# EasyEDA Pro project 2Axis-5.0-南塘 - (0522).eprj, board 2轴南塘
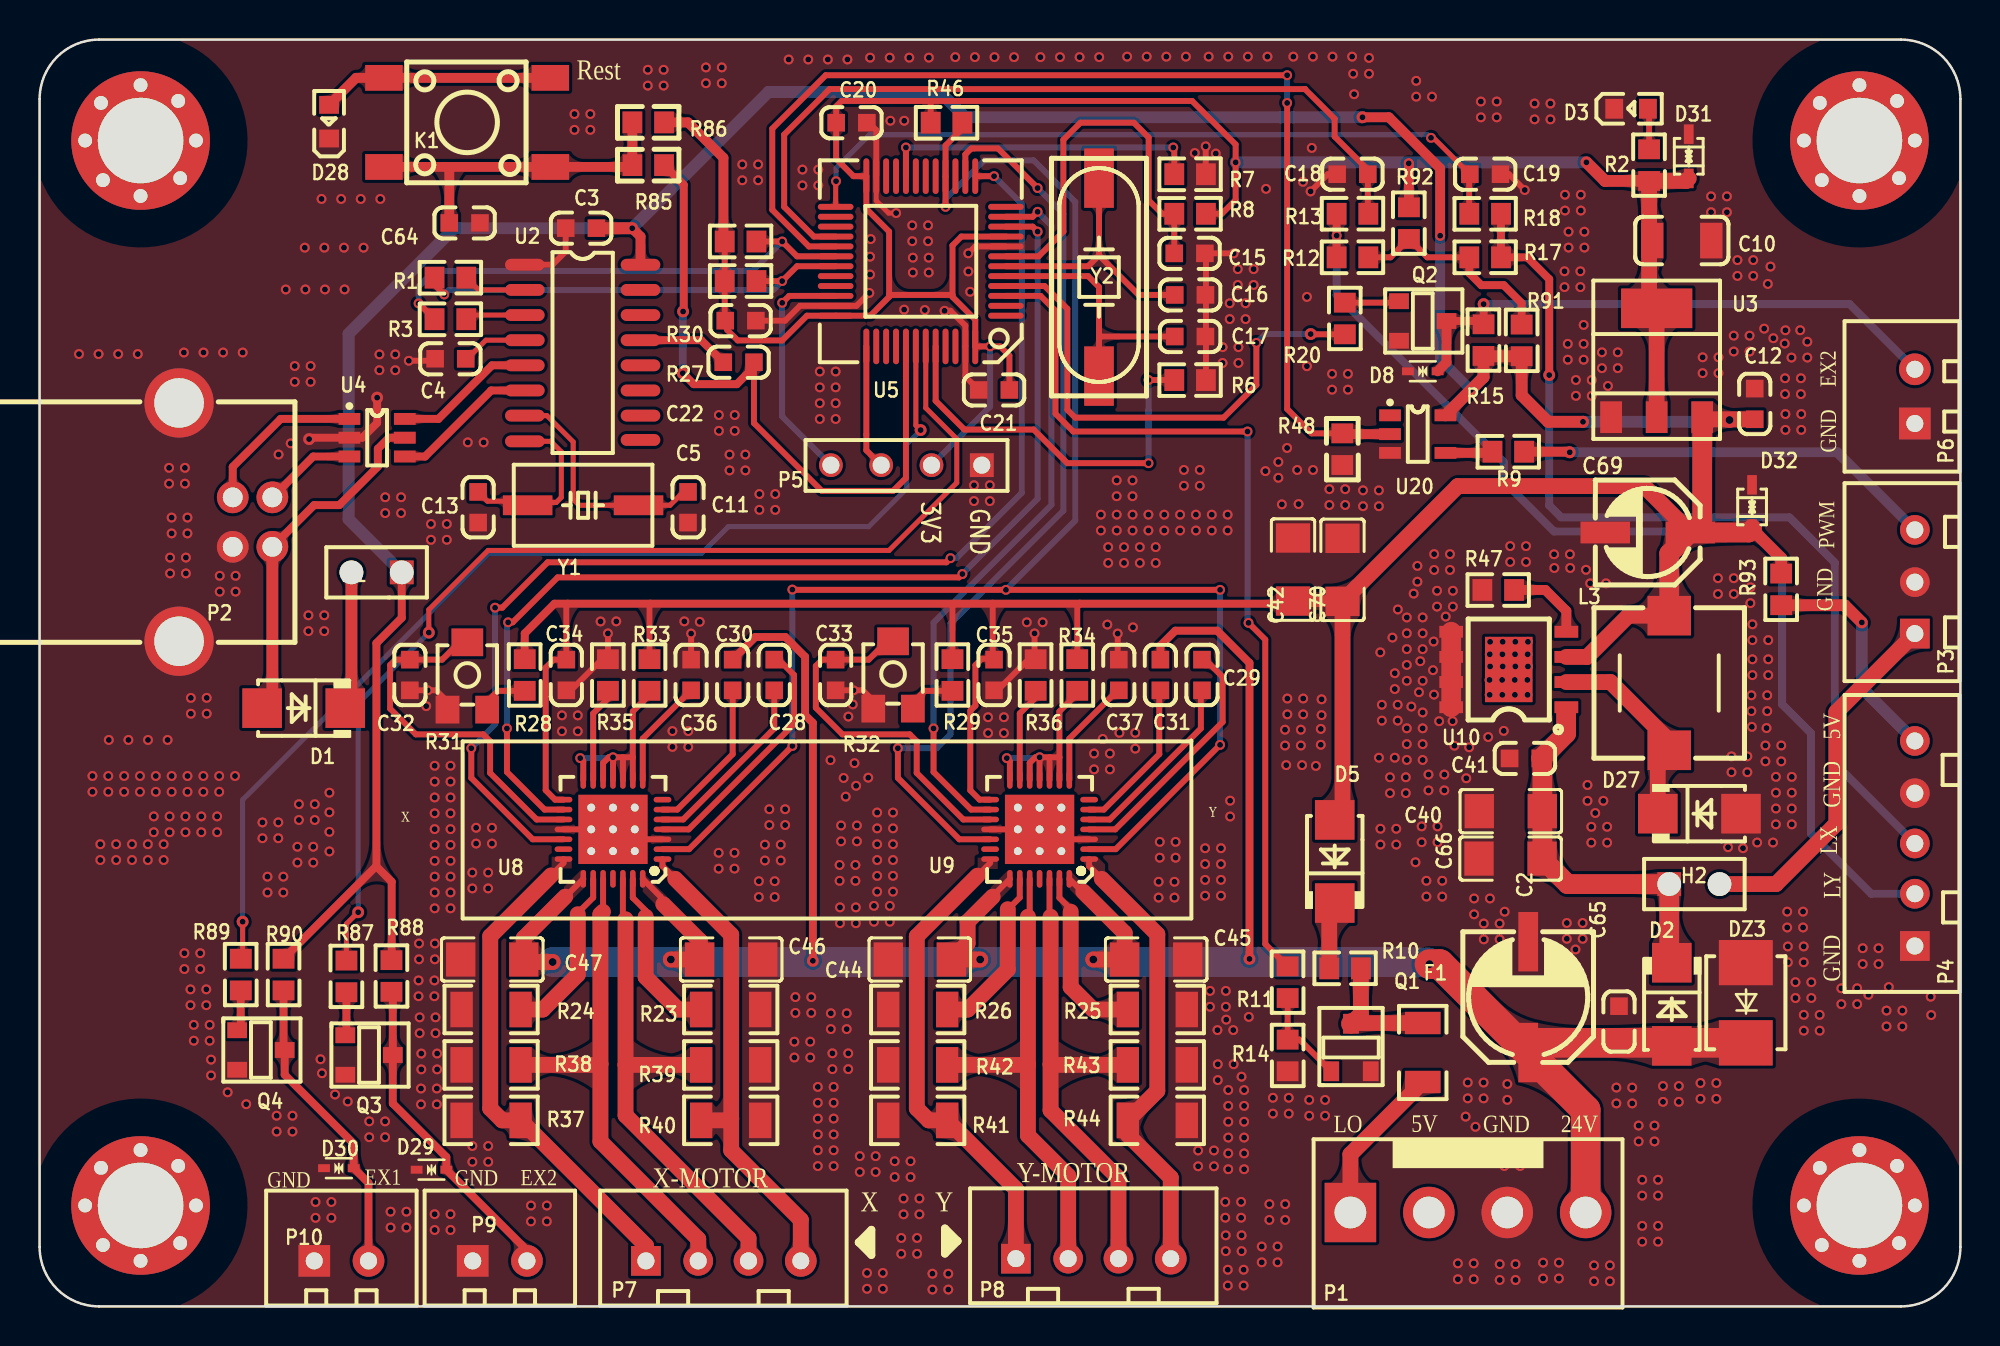
[diagram p2: board, top side]
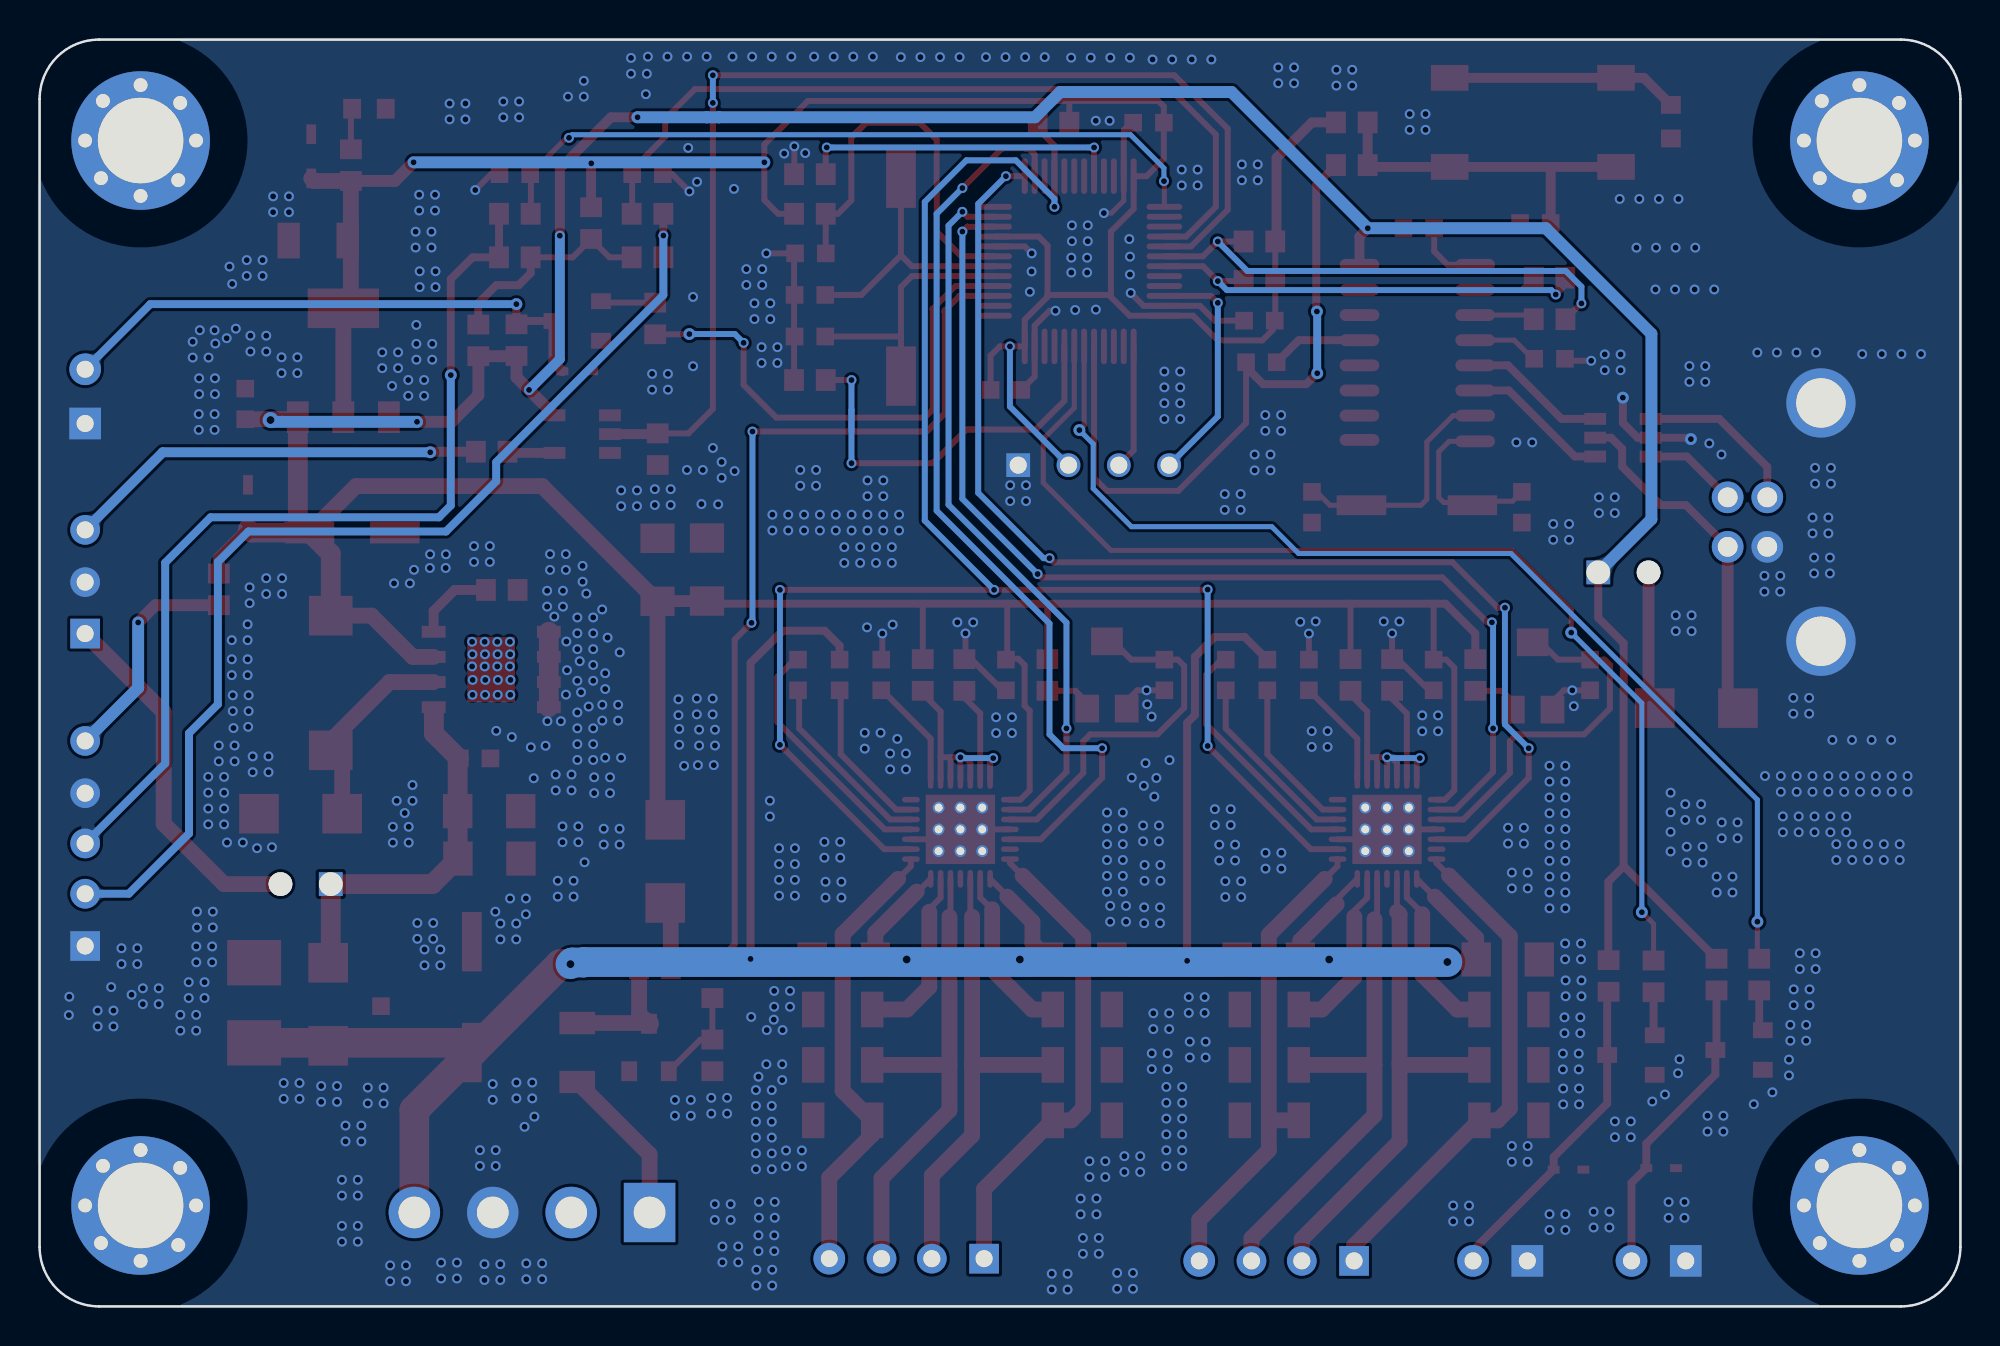
[diagram p3: board, bottom side, seen from below]

Outline 97 x 64 mm; copper layers: Top Layer, Bottom Layer. Coordinates in mm from the lower left corner of the outline.
Outline path: 0,61 0,3 arc(0.88,0.88) 3,0 94,0 arc(96.12,0.88) 97,3 97,61 arc(96.12,63.12) 94,64 3,64 arc(0.88,63.12) 0,61
Stack: Top Layer 0.0356mm / Dielectric1 0.32mm FR-4 er 4.8 / Bottom Layer 0.0356mm

## Design rules (mm)
net C1: M2-9764
net C2: M2-9764
net C3: M2-9764
net C4: M2-9764
net C5: M2-9764
net C6: M2-9764
net C8: M2-9764
net C9: M2-9764
net C10: M2-9764
net C11: M2-9764
net C12: M2-9764
net C13: M2-9764
net C15: M2-9764
net C16: M2-9764
net C17: M2-9764
net C18: M2-9764
net C19: M2-9764
net C20: M2-9764
net C21: M2-9764
net C22: M2-9764
net C23: M2-9764
net C24: M2-9764
net C25: M2-9764
net C26: M2-9764
net C27: M2-9764
net C28: M2-9764
net C29: M2-9764
net C30: M2-9764
net C31: M2-9764
net C32: M2-9764
net C33: M2-9764
net C34: M2-9764
net C35: M2-9764
net C36: M2-9764
net C37: M2-9764
net C38: M2-9764
net D1: M2-9764
net D2: M2-9764
net D3: M2-9764
net D5: M2-9764
net D6: M2-9764
net DZ2: M2-9764
net DZ3: M2-9764
net DZ4: M2-9764
net DZ5: M2-9764
net F1: M2-9764
net P1: M2-9764
net P2: M2-9764
net P3: M2-9764
net P4: M2-9764
net P5: M2-9764
net P6: M2-9764
net P7: M2-9764
net P8: M2-9764
net P10: M2-9764
net Q1: M2-9764
net Q2: M2-9764
net R1: M2-9764
net R2: M2-9764
net R3: M2-9764
net R6: M2-9764
net R7: M2-9764
net R8: M2-9764
net R9: M2-9764
net R10: M2-9764
net R11: M2-9764
net R12: M2-9764
net R13: M2-9764
net R15: M2-9764
net R16: M2-9764
net R17: M2-9764
net R18: M2-9764
net R19: M2-9764
net R20: M2-9764
net R22: M2-9764
net R23: M2-9764
net R24: M2-9764
net R25: M2-9764
net R26: M2-9764
net R28: M2-9764
net R29: M2-9764
net R31: M2-9764
net R32: M2-9764
net R33: M2-9764
net R34: M2-9764
net R35: M2-9764
net R36: M2-9764
net R37: M2-9764
net R38: M2-9764
net R39: M2-9764
net R40: M2-9764
net R41: M2-9764
net R42: M2-9764
net R43: M2-9764
net R44: M2-9764
net R45: M2-9764
net U1: M2-9764
net U2: M2-9764
net U3: M2-9764
net U4: M2-9764
net U5: M2-9764
net U7: M2-9764
net U8: M2-9764
net U9: M2-9764
net Y1: M2-9764
net Y2: M2-9764
net J1: M2-9764
net R46: M2-9764
net R14: M2-9764
net R21: M2-9764
net R27: M2-9764
net R30: M2-9764
net U10: M2-9764
net : Inside Board Components
spacing Clearance (default): track to track 0.178, other pairs 0.178 to 0.178
track width Width (default): min 0.1, default 0.254, max 5
differential pair DiffPairsRouting (default): width min 0.381, default 0.381, max 0.381; gap min 0.254, default 0.254
via RoutingVias (default): diameter min 0.3, default 0.8, max 1.27; hole min 0.3, default 0.6, max 2

## Placement (name value [footprint] x y rotation side)
C2  100uF/35V  [电解电容贴片6X6]  75.17 15.63 90 top
C3  104  [0603C]  27.35 54.47 180 top
C4  104  [0603C]  20.75 47.87 180 top
C5  104  [0603C]  35.3 47.7 0 top
C10  106/50V  [1206C]  82.93 53.85 0 top
C11  18pF  [0603C]  32.75 40.37 270 top
C12  104  [0603C]  86.61 45.59 270 top
C13  18pF  [0603C]  22.15 40.37 270 top
C15  104  [0603C]  58.07 53.2 180 top
C16  100pF  [0603C]  58.1 51.1 0 top
C17  100pF  [0603C]  58.1 49 0 top
C18  104  [0603C]  66.3 57.2 0 top
C19  104  [0603C]  73 57.2 180 top
C20  104  [0603C]  41 59.8 180 top
C21  104  [0603C]  48.2 46.3 0 top
C22  104  [0603C]  35.4 49.8 180 top
C28  104  [0603C]  37.1 31.9 270 top
C29  104  [0603C]  58.7 31.9 270 top
C30  104  [0603C]  35 31.9 90 top
C31  104  [0603C]  56.6 31.9 90 top
C32  104  [0603C]  18.7 31.9 270 top
C33  104  [0603C]  40.2 31.9 270 top
C34  104  [0603C]  26.6 31.9 270 top
C35  104  [0603C]  48.2 31.9 270 top
C36  224  [0603C]  32.9 31.9 90 top
C37  224  [0603C]  54.5 31.9 90 top
C40  10uF  [C1206]  74.29 25.02 0 top
C41  104  [0603C]  75.01 27.68 0 top
C42  10uF  [C1206]  63.3 37.23 90 top
C44  10uF  [C1206]  44.45 17.53 180 top
C45  10uF  [C1206]  56.39 17.53 0 top
C46  10uF  [C1206]  34.93 17.53 0 top
C47  10uF  [C1206]  22.86 17.53 180 top
C64  103  [0603C]  21.46 54.74 180 top
C65  104  [0603C]  79.76 14.39 90 top
C66  10uF  [C1206]  74.28 22.62 180 top
C69  100uF/10V  [CAP-SMD_BD5.0-L5.3-W5.3-RD]  81.22 39.1 0 top
C70  10uF  [C1206]  65.8 37.21 90 top
D1  SS34  [SMA]  13.33 30.23 180 top
D2  SS56  [SMA]  82.43 15.26 270 top
D3  绿光  [0603LED]  80.34 60.49 180 top
D5  SS34  [SMA]  65.41 22.48 90 top
D8  ESD05V52D-C  [SOD-523_L1.2-W0.8-LS1.6-BI]  69.85 47.24 0 top
D27  SS34  [SMA]  83.82 24.89 0 top
D28  绿光  [0603LED]  14.64 59.82 270 top
D29  ESD05V52D-C  [SOD-523_L1.2-W0.8-LS1.6-BI]  19.79 6.91 0 top
D30  ESD05V52D-C  [SOD-523_L1.2-W0.8-LS1.6-BI]  15.11 6.99 0 top
D31  PESD3V3L1BA-N  [SOD-323_L1.8-W1.3-LS2.5-BI]  83.28 58.11 270 top
D32  PESD5V0L1BA-N  [SOD-323_L1.8-W1.3-LS2.5-BI]  86.48 40.39 270 top
DZ3  SMBJ28A  [SMB]  86.16 15.34 90 top
F1  6V/0.75A  [1206R]  69.85 12.83 270 top
H1  PZ254V-11-02P  [HDR-TH_2P-P2.54-V-M]  17.02 37.08 180 top
H2  PZ254V-11-02P  [HDR-TH_2P-P2.54-V-M]  83.57 21.34 0 top
K1  SW_6X6_H=12.0MM  [KEY-SMD_4P-L6.0-W6.0-P4.50-LS9.0]  21.59 59.82 0 top
L3  68uH  [IND-SMD_L7.0-W7.0_SMDRI74-330MT]  82.3 31.5 270 top
NOREF  -  [Pad_ie56]  30.06 23 0 top
NOREF#2  -  [Pad_ie62]  30.06 25.2 0 top
NOREF#3  -  [Pad_ie85]  2.3 58.9 180 top
NOREF#4  -  [Pad_ie74]  89.1 5.1 180 top
NOREF#5  -  [Pad_ie46]  49.4 23 180 top
NOREF#6  -  [Pad_ie97]  91.9 61.7 90 top
NOREF#7  -  [Pad_ie52]  49.4 25.2 180 top
NOREF#8  -  [Pad_ie64]  7 7.1 90 top
NOREF#9  -  [Pad_ie65]  7.1 3.2 0 top
NOREF#10  -  [Pad_ie60]  28.96 24.1 270 top
NOREF#11  -  [Pad_ie90]  7.1 57 0 top
NOREF#12  -  [Pad_ie84]  5.1 61.7 90 top
NOREF#13  -  [Pad_ie98]  94.7 58.9 0 top
NOREF#14  -  [Pad_ie87]  7 60.9 90 top
NOREF#15  -  [Pad_ie71]  5.1 7.9 90 top
NOREF#16  -  [Pad_ie59]  30.06 24.1 0 top
NOREF#17  -  [Pad_ie92]  90 56.9 270 top
NOREF#18  -  [Pad_ie88]  3.1 60.8 180 top
NOREF#19  -  [Pad_ie83]  7.9 58.9 0 top
NOREF#20  -  [Pad_ie53]  51.6 25.2 0 top
NOREF#21  -  [Pad_ie48]  50.5 23 270 top
NOREF#22  -  [Pad_ie93]  89.9 60.8 180 top
NOREF#23  -  [Pad_ie89]  3.2 56.9 270 top
NOREF#24  -  [Pad_ie61]  27.86 25.2 180 top
NOREF#25  -  [Pad_ie94]  93.8 60.9 90 top
NOREF#26  -  [Pad_ie80]  93.8 7.1 90 top
NOREF#27  -  [Pad_ie75]  91.9 2.3 270 top
NOREF#28  -  [Pad_ie96]  89.1 58.9 180 top
NOREF#29  -  [Pad_ie68]  7.9 5.1 0 top
NOREF#30  -  [Pad_ie66]  3.2 3.1 270 top
NOREF#31  -  [Pad_ie69]  5.1 2.3 270 top
NOREF#32  -  [Pad_ie67]  3.1 7 180 top
NOREF#33  -  [Pad_ie99]  91.9 56.1 270 top
NOREF#34  -  [Pad_ie95]  93.9 57 0 top
NOREF#35  -  [Pad_ie57]  28.96 23 270 top
NOREF#36  -  [Pad_ie86]  5.1 56.1 270 top
NOREF#37  -  [Pad_ie49]  49.4 24.1 180 top
NOREF#38  -  [Pad_ie79]  93.9 3.2 0 top
NOREF#39  -  [Pad_ie100]  91.9 58.9 270 top
NOREF#40  -  [Pad_ie58]  27.86 24.1 180 top
NOREF#41  -  [Pad_ie51]  50.5 24.1 270 top
NOREF#42  -  [Pad_ie82]  5.1 58.9 0 top
NOREF#43  -  [Pad_ie70]  2.3 5.1 180 top
NOREF#44  -  [Pad_ie55]  27.86 23 180 top
NOREF#45  -  [Pad_ie47]  51.6 23 0 top
NOREF#46  -  [Pad_ie81]  89.9 7 180 top
NOREF#47  -  [Pad_ie78]  90 3.1 270 top
NOREF#48  -  [Pad_ie77]  91.9 7.9 90 top
NOREF#49  -  [Pad_ie63]  28.96 25.2 0 top
NOREF#50  -  [Pad_ie50]  51.6 24.1 0 top
NOREF#51  -  [Pad_ie73]  91.9 5.1 180 top
NOREF#52  -  [Pad_ie54]  50.5 25.2 0 top
NOREF#53  -  [Pad_ie72]  5.1 5.1 90 top
NOREF#54  -  [Pad_ie76]  94.7 5.1 0 top
P1  Header 4  [VH3.96-4P直插座]  72.14 4.44 180 top
P2  USB-B10-BRW  [USB-B-TH_USB-B10-BRW]  9.4 39.62 270 top
P3  3P  [HDR1X3_CON]  94.7 36.59 90 top
P4  Header 5  [HDR1X5_CON]  94.7 23.39 90 top
P5  4P  [SIP4]  47.58 42.5 180 top
P6  2P  [HDR1X2_CON]  94.7 45.97 90 top
P7  4P  [HDR1X4_CON]  30.72 2.3 0 top
P8  4P  [HDR1X4_CON]  49.4 2.41 0 top
P9  2P  [HDR1X2_CON]  23.24 2.3 0 top
P10  2P  [HDR1X2_CON]  15.24 2.3 0 top
Q1  S8050  [SOT-23]  66.23 13.08 0 top
Q2  S8050  [SOT-23]  69.85 49.78 270 top
Q3  S8050  [SOT-23]  16.64 12.7 270 top
Q4  S8050  [SOT-23]  11.18 12.95 270 top
R1  510Ω  [0603R]  20.75 51.97 180 top
R2  10K  [0603R]  81.28 57.66 90 top
R3  510Ω  [0603R]  20.75 49.87 180 top
R6  10K  [0603R]  58.1 46.8 180 top
R7  10K  [0603R]  58.1 57.2 180 top
R8  10K  [0603R]  58.1 55.2 180 top
R9  100  [0603R]  74.17 43.18 180 top
R10  5.1K  [0603R]  65.93 17.08 0 top
R11  2K  [0603R]  63.03 16.38 90 top
R12  10K  [0603R]  66.3 53 0 top
R13  0  [0603R]  66.3 55.2 0 top
R14  10K  [0603R]  63.03 12.68 270 top
R15  10K  [0603R]  72.92 48.82 90 top
R17  10K  [0603R]  73 53 0 top
R18  0  [0603R]  73 55.2 180 top
R20  2K  [0603R]  65.91 49.91 270 top
R23  0.1  [1206R]  34.9 15 0 top
R24  0.1  [1206R]  22.8 15 0 top
R25  0.1  [1206R]  56.44 15 0 top
R26  0.1  [1206R]  44.34 15 0 top
R27  10K  [0603R]  35.4 51.8 0 top
R28  10K  [0603R]  24.5 31.9 90 top
R29  10K  [0603R]  46.1 31.9 90 top
R30  10K  [0603R]  35.4 53.8 0 top
R31  10K  [松下贴片电位器3x3]  21.6 31.9 0 top
R32  10K  [松下贴片电位器3x3]  43.1 31.95 0 top
R33  10K  [0603R]  30.8 31.9 270 top
R34  10K  [0603R]  52.4 31.9 270 top
R35  10K  [0603R]  28.7 31.9 90 top
R36  10K  [0603R]  50.3 31.9 90 top
R37  1.91K  [1206R]  22.8 9.4 180 top
R38  1.91K  [1206R]  22.8 12.2 180 top
R39  1.91K  [1206R]  34.9 12.2 0 top
R40  1.91K  [1206R]  34.9 9.4 0 top
R41  1.91K  [1206R]  44.34 9.4 180 top
R42  1.91K  [1206R]  44.34 12.2 180 top
R43  1.91K  [1206R]  56.44 12.2 0 top
R44  1.91K  [1206R]  56.44 9.4 0 top
R46  10K  [0603R]  45.8 59.8 180 top
R47  10K  [0603R]  73.66 36.19 180 top
R48  10K  [0603R]  65.79 43.31 270 top
R85  100  [0603R]  30.73 57.66 180 top
R86  10K  [0603R]  30.73 59.82 0 top
R87  2K  [0603R]  15.49 16.67 90 top
R88  10K  [0603R]  17.77 16.69 270 top
R89  2K  [0603R]  10.16 16.76 90 top
R90  10K  [0603R]  12.32 16.76 270 top
R91  0Ω  [0603R]  74.84 48.8 270 top
R92  0Ω  [0603R]  69.15 54.73 90 top
R93  0Ω  [0603R]  87.95 36.22 90 top
U2  CH340G  [SOP16]  27.42 48.81 0 top
U3  1117-3.3  [SOT-223]  81.66 47.62 0 top
U4  USBLC2-2SC6  [SOT-23-6]  17.04 43.89 0 top
U5  STM32F103C8T6/CBT6  [LQFP48]  44.5 52.8 180 top
U8  HR4988SQ  [QFN28]  28.7 24.2 90 top
U9  HR4988SQ  [QFN28]  50.24 24.2 90 top
U10  XL1509-5.0E1  [ESOP-8_L4.9-W3.9-P1.27-LS6.0-BL-EP]  74.19 32.18 90 top
U20  74LVC1G17  [SOT-23-5]  69.6 44.07 0 top
Y1  12M  [晶振贴片49SSMD]  27.45 40.47 0 top
Y2  8M  [晶振贴片]  53.5 52 90 top

## Footprints (pads in the part's own frame, mm; a bottom-side part is the same pattern mirrored in y, then rotated)
0603C
  rect 0.889x0.889 smd: 1(-0.774,0) 2(0.774,0)
0603LED
  rect 0.9x1 smd: 1(-0.884,-0.017) 2(0.816,-0.017)
0603R
  rect 1x1.1 smd: 1(-0.8,0) 2(0.8,0)
1206C
  rect 1.13x1.8 smd: 1(-1.49,0) 2(1.49,0)
1206R
  rect 1.13x1.8 smd: 1(-1.49,0) 2(1.49,0)
C1206
  rect 1.485x1.728 smd: 1(-1.593,0) 2(1.593,0)
CAP-SMD_BD5.0-L5.3-W5.3-RD
  rect 2.5x1.1 smd: 1(2.15,0) 2(-2.15,0)
ESOP-8_L4.9-W3.9-P1.27-LS6.0-BL-EP
  rect 0.6x1.2 smd: 1(-1.905,-2.909) 2(-0.635,-2.909) 3(0.635,-2.909) 4(1.905,-2.909) 5(1.905,2.909) 6(0.635,2.909) 7(-0.635,2.909) 8(-1.905,2.909)
  rect 3.3x2.4 smd: 9(0,0)
HDR1X2_CON
  rect 1.6x1.6 hole 0.86: 1(-1.37,0)
  round 1.6 hole 0.86: 2(1.37,0)
HDR1X3_CON
  rect 1.5x1.5 hole 0.86: 1(-2.6,0)
  round 1.5 hole 0.86: 2(0,0) 3(2.64,0)
HDR1X4_CON
  rect 1.5x1.5 hole 0.86: 1(-0.1,0)
  round 1.5 hole 0.86: 2(2.54,0) 3(5.08,0)
  round 1.6 hole 0.85: 4(7.72,0)
HDR1X5_CON
  rect 1.5x1.5 hole 0.86: 1(-5.18,0)
  round 1.5 hole 0.86: 2(-2.54,0) 3(0,0) 4(2.54,0) 5(5.18,0)
HDR-TH_2P-P2.54-V-M
  rect 1.2x1.2 hole 1.2x0.8: 1(-1.27,0)
  round 1.2 hole 1.2x0.8: 2(1.27,0)
IND-SMD_L7.0-W7.0_SMDRI74-330MT
  rect 2x2.2 smd: 1(-3.4,0) 2(3.4,0)
KEY-SMD_4P-L6.0-W6.0-P4.50-LS9.0
  rect 1.9x1.3 smd: 1(-4.2,2.25) 2(4.2,2.25) 3(-4.2,-2.25) 4(4.2,-2.25)
LQFP48
  oval 1.8x0.3 smd: 1(-4.3,2.75) 2(-4.3,2.25) 3(-4.3,1.75) 4(-4.3,1.25) 5(-4.3,0.75) 6(-4.3,0.25) 7(-4.3,-0.25) 8(-4.3,-0.75) 9(-4.3,-1.25) 10(-4.3,-1.75) 11(-4.3,-2.25) 12(-4.3,-2.75) 25(4.3,-2.75) 26(4.3,-2.25) 27(4.3,-1.75) 28(4.3,-1.25) 29(4.3,-0.75) 30(4.3,-0.25) 31(4.3,0.25) 32(4.3,0.75) 33(4.3,1.25) 34(4.3,1.75) 35(4.3,2.25) 36(4.3,2.75)
  oval 0.3x1.8 smd: 13(-2.75,-4.3) 14(-2.25,-4.3) 15(-1.75,-4.3) 16(-1.25,-4.3) 17(-0.75,-4.3) 18(-0.25,-4.3) 19(0.25,-4.3) 20(0.75,-4.3) 21(1.25,-4.3) 22(1.75,-4.3) 23(2.25,-4.3) 24(2.75,-4.3) 37(2.75,4.3) 38(2.25,4.3) 39(1.75,4.3) 40(1.25,4.3) 41(0.75,4.3) 42(0.25,4.3) 43(-0.25,4.3) 44(-0.75,4.3) 45(-1.25,4.3) 46(-1.75,4.3) 47(-2.25,4.3) 48(-2.75,4.3)
Pad_ie46
  round 0.6 hole 0.4: 5(0,0)
Pad_ie47
  round 0.6 hole 0.4: 5(0,0)
Pad_ie48
  round 0.6 hole 0.4: 5(0,0)
Pad_ie49
  round 0.6 hole 0.4: 5(0,0)
Pad_ie50
  round 0.6 hole 0.4: 5(0,0)
Pad_ie51
  round 0.6 hole 0.4: 5(0,0)
Pad_ie52
  round 0.6 hole 0.4: 5(0,0)
Pad_ie53
  round 0.6 hole 0.4: 5(0,0)
Pad_ie54
  round 0.6 hole 0.4: 4(0,0)
Pad_ie55
  round 0.6 hole 0.4: 5(0,0)
Pad_ie56
  round 0.6 hole 0.4: 5(0,0)
Pad_ie57
  round 0.6 hole 0.4: 5(0,0)
Pad_ie58
  round 0.6 hole 0.4: 5(0,0)
Pad_ie59
  round 0.6 hole 0.4: 5(0,0)
Pad_ie60
  round 0.6 hole 0.4: 5(0,0)
Pad_ie61
  round 0.6 hole 0.4: 5(0,0)
Pad_ie62
  round 0.6 hole 0.4: 5(0,0)
Pad_ie63
  round 0.6 hole 0.4: 4(0,0)
Pad_ie64
  round 1 hole 0.7: 1(0,0)
Pad_ie65
  round 1 hole 0.7: 1(0,0)
Pad_ie66
  round 1 hole 0.7: 1(0,0)
Pad_ie67
  round 1 hole 0.7: 1(0,0)
Pad_ie68
  round 1 hole 0.7: 1(0,0)
Pad_ie69
  round 1 hole 0.7: 1(0,0)
Pad_ie70
  round 1 hole 0.7: 1(0,0)
Pad_ie71
  round 1 hole 0.7: 1(0,0)
Pad_ie72
  round 7 hole 4.32: 0(0,0)
Pad_ie73
  round 7 hole 4.32: 0(0,0)
Pad_ie74
  round 1 hole 0.7: 1(0,0)
Pad_ie75
  round 1 hole 0.7: 1(0,0)
Pad_ie76
  round 1 hole 0.7: 1(0,0)
Pad_ie77
  round 1 hole 0.7: 1(0,0)
Pad_ie78
  round 1 hole 0.7: 1(0,0)
Pad_ie79
  round 1 hole 0.7: 1(0,0)
Pad_ie80
  round 1 hole 0.7: 1(0,0)
Pad_ie81
  round 1 hole 0.7: 1(0,0)
Pad_ie82
  round 7 hole 4.32: 0(0,0)
Pad_ie83
  round 1 hole 0.7: 1(0,0)
Pad_ie84
  round 1 hole 0.7: 1(0,0)
Pad_ie85
  round 1 hole 0.7: 1(0,0)
Pad_ie86
  round 1 hole 0.7: 1(0,0)
Pad_ie87
  round 1 hole 0.7: 1(0,0)
Pad_ie88
  round 1 hole 0.7: 1(0,0)
Pad_ie89
  round 1 hole 0.7: 1(0,0)
Pad_ie90
  round 1 hole 0.7: 1(0,0)
Pad_ie92
  round 1 hole 0.7: 1(0,0)
Pad_ie93
  round 1 hole 0.7: 1(0,0)
Pad_ie94
  round 1 hole 0.7: 1(0,0)
Pad_ie95
  round 1 hole 0.7: 1(0,0)
Pad_ie96
  round 1 hole 0.7: 1(0,0)
Pad_ie97
  round 1 hole 0.7: 1(0,0)
Pad_ie98
  round 1 hole 0.7: 1(0,0)
Pad_ie99
  round 1 hole 0.7: 1(0,0)
Pad_ie100
  round 7 hole 4.32: 0(0,0)
QFN28
  oval 0.28x0.895 smd: 1(-1.601,-2.756) 2(-1.101,-2.756) 3(-0.601,-2.756) 4(-0.1,-2.756) 5(0.401,-2.756) 6(0.9,-2.756) 7(1.401,-2.756) 15(1.401,2.244) 16(0.9,2.244) 17(0.401,2.244) 18(-0.1,2.244) 19(-0.601,2.244) 20(-1.101,2.244) 21(-1.601,2.244)
  oval 0.895x0.28 smd: 8(2.4,-1.758) 9(2.4,-1.257) 10(2.4,-0.756) 11(2.4,-0.256) 12(2.4,0.244) 13(2.4,0.745) 14(2.4,1.245) 22(-2.6,1.245) 23(-2.6,0.745) 24(-2.6,0.244) 25(-2.6,-0.256) 26(-2.6,-0.756) 27(-2.6,-1.257) 28(-2.6,-1.758)
  rect 3.5x3.5 smd: 29(-0.1,-0.256)
SIP4
  rect 1.2x1.2 hole 0.86: 1(0,0)
  round 1.2 hole 0.86: 2(2.54,0) 3(5.08,0) 4(7.62,0)
SMA
  rect 2x2 smd: 1(2.1,0) 2(-2.1,0)
SMB
  rect 2.29x2.72 smd: 1(2.025,0) 2(-2.025,0)
SOD-323_L1.8-W1.3-LS2.5-BI
  rect 0.986x0.49 smd: 1(-1.117,0) 2(1.117,0)
SOD-523_L1.2-W0.8-LS1.6-BI
  rect 0.6x0.4 smd: 1(-0.75,0) 2(0.75,0)
SOP16
  oval 2x0.6 smd: 1(-2.921,3.81) 2(-2.921,2.54) 3(-2.921,1.27) 4(-2.921,0) 5(-2.921,-1.27) 6(-2.921,-2.54) 7(-2.921,-3.81) 8(-2.921,-5.11) 9(2.921,-5.04) 10(2.921,-3.81) 11(2.921,-2.54) 12(2.921,-1.27) 13(2.921,0) 14(2.921,1.27) 15(2.921,2.54) 16(2.921,3.81)
SOT-23
  rect 0.8x1 smd: 1(-1,-1.2) 2(0,1.2) 3(1,-1.2)
SOT-23-5
  rect 1.1x0.6 smd: 1(-1.4,0.95) 2(-1.4,0) 3(-1.4,-0.95) 4(1.4,-0.95) 5(1.4,0.95)
SOT-23-6
  rect 1.1x0.6 smd: 1(-1.4,0.95) 2(-1.4,0) 3(-1.4,-0.95) 4(1.4,-0.95) 5(1.4,0) 6(1.4,0.95)
SOT-223
  rect 1.1x1.6 smd: 1(-2.3,-2.7) 2(0,-2.7) 3(2.3,-2.7)
  rect 3.6x2 smd: 4(0,2.8)
USB-B-TH_USB-B10-BRW
  round 1.6 hole 1: 1(1.25,2.355) 2(-1.25,2.355) 3(-1.25,0.355) 4(1.25,0.355)
  round 3.5 hole 2.5: 5(-6.02,-2.355) 6(6.02,-2.355)
VH3.96-4P直插座
  rect 2.6x3 hole 1.6: 1(5.94,-0.3)
  round 2.6 hole 1.6: 2(1.98,-0.3) 3(-1.98,-0.3) 4(-5.94,-0.3)
晶振贴片
  rect 3x1.5 smd: 1(-5,0) 2(5,0)
晶振贴片49SSMD
  rect 2.5x1 smd: 1(-2.8,0) 2(2.8,0)
松下贴片电位器3x3
  rect 1.2x1.4 smd: 1(-1,-1.75) 3(1,-1.75)
  rect 1.6x1.4 smd: 2(0,1.65)
电解电容贴片6X6
  rect 3x1 smd: 1(-2.8,0) 2(2.8,0)

## Nets
As in the schematic, except:
GND: C2.2 C3.2 C4.2 C10.2 C11.2 C12.1 C13.2 C15.1 C16.2 C17.2 C18.1 C19.1 C20.1 C21.1 C22.1 C32.2 C33.2 C34.2 C35.2 C36.2 C37.2 C40.1 C41.1 C42.2 C44.2 C45.2 C46.2 C47.2 C64.1 C65.2 C66.2 C69.2 C70.2 D3.2 D8.1 D27.1 D28.2 D29.1 D30.1 D31.1 D32.1 DZ3.1 NOREF.5 NOREF#2.5 NOREF#5.5 NOREF#7.5 NOREF#10.5 NOREF#16.5 NOREF#20.5 NOREF#21.5 NOREF#24.5 NOREF#35.5 NOREF#37.5 NOREF#40.5 NOREF#41.5 NOREF#44.5 NOREF#45.5 NOREF#49.4 NOREF#50.5 NOREF#52.4 P1.3 P2.4 P2.5 P2.6 P3.2 P4.1 P4.4 P5.1 P6.1 P9.1 P10.1 Q1.3 Q2.3 Q3.3 Q4.3 R6.1 R7.1 R14.2 R23.2 R24.1 R25.2 R26.1 R31.1 R32.1 R35.2 R36.2 R37.2 R38.2 R39.2 R40.2 R41.2 R42.2 R43.2 R44.2 R47.2 R48.2 U2.1 U3.1 U4.2 U5.8 U5.23 U5.35 U5.47 U8.3 U8.18 U9.3 U9.18 U10.5 U10.6 U10.7 U10.8 U20.3

Pads without a net: NOREF#3 1; NOREF#4 1; NOREF#6 1; NOREF#8 1; NOREF#9 1; NOREF#11 1; NOREF#12 1; NOREF#13 1; NOREF#14 1; NOREF#15 1; NOREF#17 1; NOREF#18 1; NOREF#19 1; NOREF#22 1; NOREF#23 1; NOREF#25 1; NOREF#26 1; NOREF#27 1; NOREF#28 1; NOREF#29 1; NOREF#30 1; NOREF#31 1; NOREF#32 1; NOREF#33 1; NOREF#34 1; NOREF#36 1; NOREF#38 1; NOREF#39 0; NOREF#42 0; NOREF#43 1; NOREF#46 1; NOREF#47 1; NOREF#48 1; NOREF#51 0; NOREF#53 0; NOREF#54 1; U2 9 10 11 12 14 15; U5 1; U8 7 20 25 29; U9 7 20 25 29; U10 9; U20 1

## Via types
v1: diameter 0.5, hole 0.3, Top Layer to Bottom Layer, 994 vias
v2: diameter 0.6, hole 0.3, Top Layer to Bottom Layer, 17 vias
v3: diameter 0.8, hole 0.4, Top Layer to Bottom Layer, 6 vias

## Routing (per net, layer and track width the routed paths; a pad name or vN(x,y) marks a point on that pad's centre or on a via; arc(x,y) is an arc through that point)
3V3: length 119.9
  Top Layer w0.3: 40.03,59.9 40.03,59.93 ; 45,60.9 40.5,60.9 40.23,60.63 C20.2 40.23,57.97 41.1,57.1 U5.24 41.75,55.45 42.9,54.3 42.9,51.1 ; 45,60.9 45,59.9 ; 45,60.9 58.2,60.9 60.4,58.7 v1(60.4,57.8) 60.4,55.9 59.7,55.2 R8.1 ; 46.1,51.1 46.1,51 47.25,49.85 U5.48 v1(48,48.5) 48.51,48.5 48.97,48.03 C21.2 ; 46.1,51.1 42.9,51.1 ; 46.1,51.1 46.1,53.6 46.55,54.05 U5.9 ; 42.9,51.1 42.9,51 41.95,50.05 U5.36 38.75,50.05 37.5,48.8 35.26,48.8 34.73,49.33 34.73,49.8 ; R30.1 R27.1 34.6,49.83 C22.2
  Top Layer w0.5: v1(69.14,57.75) 69.15,57.74 R92.2 ; R30.1 34.53,53.87 34.53,58.03 32.74,59.82 R86.2
  Top Layer w0.6: v1(78.11,57.8) 79.06,56.86 R2.1
  Top Layer w0.8: U3.2 U3.4 81.28,50.81 R2.1 83.15,56.86 D31.2
  Bottom Layer w0.3: P5.2 48,45.46 v1(48,48.5)
  Bottom Layer w0.6: v1(60.4,57.8) v1(78.11,57.8)
24V: length 18.9
  Top Layer w1: 77.09,29.97 77.09,28.94 75.83,27.69 75.89,27.63 C40.2 75.89,22.64 C66.1 77.16,21.34 H2.1 82.3,17.49 D2.2
GND: length 67.5
  Top Layer w0.254: v1(43.25,55.24) 42.87,55.24 42.25,55.86 U5.23
  Top Layer w0.3: 26.83,31.12 28.38,32.68 ; U9.3 51,23.6 NOREF#41.5 ; 40.24,31.13 41.57,31.13 42.14,30.55 ; C32.2 20.02,31.13 20.6,30.55 ; R7.1 58.89,57.21 v1(58.89,58.61) ; 28.7,32.68 v1(28.7,34) ; NOREF#10.5 29.46,23.6 U8.3 ; 74.1,57.2 C19.1 74.2,57.2 v1(75,56.4) ; U5.8 47.25,53.55 v1(46.9,53.2) ; 50.24,32.68 v1(50.24,34) ; v1(64.18,56.33) 65.05,57.2 C18.1 ; C21.1 46.75,46.98 U5.47 46.75,49.55 46,50.3 v1(45.7,50.3) ; U9.18 NOREF#37.5 ; C3.2 26.57,53.3 25.9,52.62 U2.1 ; U5.23 42.25,59.42 41.77,59.9 ; C22.1 37.65,49.8 38.4,50.55 U5.35 41.25,50.55 v1(41.9,51.2) ; U8.18 NOREF#40.5 ; 54.44,32.67 v1(54.44,33.99) ; C36.2 v1(32.9,33.99) ; v1(18.65,47.77) 19.95,47.77 ; 48.37,31.12 49.93,32.68 ; R6.1 58.9,53.15 58.85,53.2 v1(60.3,53.2)
  Top Layer w0.4: v2(17.04,45.91) 17.04,44.63 16.3,43.89 U4.2 13.68,43.89 v2(13.61,43.82)
  Top Layer w1: U10.8 U10.7 U10.6 U10.5
  vias: v1(1.99,48.11) v1(2.67,26.8) v1(2.67,26) v1(2.98,48.11) v1(3.07,23.35) v1(3.07,22.55) v1(3.5,28.62) v1(3.47,26.8) v1(3.47,26) v1(3.87,23.35) v1(3.87,22.55) v1(3.97,48.11) v1(4.27,26.8) v1(4.27,26) v1(4.48,28.62) v1(4.67,23.35) v1(4.67,22.55) v1(4.96,48.11) v1(5.07,26.8) v1(5.07,26) v1(5.47,28.62) v1(5.47,23.35) v1(5.47,22.55) v1(5.77,24.75) v1(5.77,23.95) v1(5.87,26.8) v1(5.87,26) v1(6.27,23.35) v1(6.27,22.55) v1(6.54,42.36) v1(6.54,41.56) v1(6.46,28.62) v1(6.59,37.83) v1(6.59,37.03) v1(6.57,24.75) v1(6.57,23.95) v1(6.67,39.85) v1(6.67,39.05) v1(6.67,26.8) v1(6.67,26) v1(7.29,48.19) v1(7.34,42.36) v1(7.34,41.56) v1(7.31,17.84) v1(7.31,17.04) v1(7.39,37.83) v1(7.39,37.03) v1(7.37,24.75) v1(7.37,23.95) v1(7.47,39.85) v1(7.47,39.05) v1(7.47,26.8) v1(7.47,26) v1(7.64,30.74) v1(7.64,29.94) v1(7.62,16.02) v1(7.62,15.22) v1(7.79,14.22) v1(7.79,13.42) v1(8.11,17.84) v1(8.11,17.04) v1(8.17,24.75) v1(8.17,23.95) v1(8.28,48.19) v1(8.27,26.8) v1(8.27,26) v1(8.44,30.74) v1(8.44,29.94) v1(8.42,16.02) v1(8.42,15.22) v1(8.59,14.22) v1(8.59,13.42) v1(8.66,12.47) v1(8.66,11.67) v1(8.97,24.75) v1(8.97,23.95) v1(9.1,36.91) v1(9.1,36.11) v1(9.07,26.8) v1(9.07,26) v1(9.27,48.19) v1(9.5,10.82) v1(9.9,36.91) v1(9.9,36.11) v1(9.87,26.8) v1(10.26,48.19) v1(10.43,10.22) v1(11.25,24.45) v1(11.25,23.65) v1(11.51,21.71) v1(11.51,20.91) v1(11.97,9.63) v1(11.97,8.83) v1(12.07,43.04) v1(12.05,24.45) v1(12.05,23.65) v1(12.31,21.71) v1(12.31,20.91) v1(12.43,51.38) v1(12.68,43.6) v1(12.77,9.63) v1(12.77,8.83) v1(12.89,47.51) v1(12.89,46.71) v1(13.02,23.22) v1(13.02,22.42) v1(13.09,25.37) v1(13.09,24.57) v1(13.39,53.49) v1(13.42,51.38) v1(13.58,34.92) v1(13.58,34.12) v1(13.69,47.51) v1(13.69,46.71) v1(13.82,23.22) v1(13.82,22.42) v1(13.89,25.37) v1(13.89,24.57) v1(13.94,5.28) v1(13.94,4.47) v1(14.24,55.95) v1(14.19,12.49) v1(14.26,11.78) v1(14.38,53.49) v1(14.41,51.38) v1(14.38,34.92) v1(14.38,34.12) v1(14.64,25.95) v1(14.64,24.96) v1(14.64,23.97) v1(14.64,22.98) v1(14.73,5.28) v1(14.73,4.47) v1(14.92,10.71) v1(15.23,55.95) v1(15.37,53.49) v1(15.4,51.38) v1(15.56,10.35) v1(16.22,55.95) v1(16.36,53.49) v1(16.65,9.35) v1(16.65,8.55) v1(17.21,55.95) v1(17.16,48.1) v1(17.16,47.3) v1(17.45,9.35) v1(17.45,8.55) v1(17.45,40.88) v1(17.45,40.08) v1(17.72,4.79) v1(17.72,3.99) v1(17.96,48.1) v1(17.96,47.3) v1(18.25,40.88) v1(18.25,40.08) v1(18.52,4.79) v1(18.52,3.99) v1(19.14,16.47) v1(19.14,15.67) v1(19.16,18.34) v1(19.16,17.54) v1(19.19,14.6) v1(19.19,13.8) v1(19.27,12.77) v1(19.27,11.97) v1(19.26,11.01) v1(19.26,10.21) v1(19.52,30.33) v1(19.6,31.13) v1(19.76,39.53) v1(19.76,38.73) v1(19.94,16.47) v1(19.94,15.67) v1(19.95,4.66) v1(19.95,3.86) v1(19.95,27.31) v1(19.95,26.51) v1(19.95,25.71) v1(19.95,24.91) v1(19.95,24.11) v1(19.95,23.31) v1(19.95,22.51) v1(19.95,21.71) v1(19.95,20.91) v1(19.95,20.11) v1(19.96,18.34) v1(19.96,17.54) v1(19.99,14.6) v1(19.99,13.8) v1(20.07,12.77) v1(20.07,11.97) v1(20.06,11.01) v1(20.06,10.21) v1(20.56,39.53) v1(20.56,38.73) v1(20.75,4.66) v1(20.75,3.86) v1(20.75,27.31) v1(20.75,26.51) v1(20.75,25.71) v1(20.75,24.91) v1(20.75,24.11) v1(20.75,23.31) v1(20.75,22.51) v1(20.75,21.71) v1(20.75,20.91) v1(20.75,20.11) v1(21.62,43.65) v1(21.85,21.92) v1(21.85,21.12) v1(21.85,8.1) v1(21.85,7.3) v1(22.04,24.18) v1(22.04,23.38) v1(22.42,43.65) v1(22.65,21.92) v1(22.65,21.12) v1(22.65,8.1) v1(22.65,7.3) v1(22.84,24.18) v1(22.84,23.38) v1(24.81,5.09) v1(24.81,4.29) v1(25.61,5.09) v1(25.61,4.29) v1(26.38,29.86) v1(26.38,29.06) v1(27.01,60.24) v1(27.01,59.44) v1(27.18,29.86) v1(27.18,29.06) v1(27.81,60.24) v1(27.81,59.44) v1(28.33,34.6) v1(29.12,34.61) v1(30.71,62.47) v1(30.71,61.67) v1(31.51,62.47) v1(31.51,61.67) v1(31.96,29.07) v1(31.96,28.27) v1(32.56,34.61) v1(32.76,29.07) v1(32.76,28.27) v1(33.34,34.58) v1(33.65,62.59) v1(33.65,61.79) v1(34.3,45.03) v1(34.3,44.23) v1(34.29,22.92) v1(34.29,22.12) v1(34.45,62.59) v1(34.45,61.79) v1(34.84,43.04) v1(34.84,42.24) v1(35.1,45.03) v1(35.1,44.23) v1(35.09,22.92) v1(35.09,22.12) v1(35.49,57.69) v1(35.49,56.89) v1(35.64,43.04) v1(35.64,42.24) v1(36.29,57.69) v1(36.29,56.89) v1(36.35,41.04) v1(36.35,40.24) v1(36.32,21.48) v1(36.32,20.68) v1(36.63,23.33) v1(36.63,22.53) v1(36.85,25.12) v1(36.85,24.32) v1(37.15,41.04) v1(37.15,40.24) v1(37.12,21.48) v1(37.12,20.68) v1(37.43,23.33) v1(37.43,22.53) v1(37.65,25.12) v1(37.65,24.32) v1(37.83,62.99) v1(38.12,13.37) v1(38.12,12.57) v1(38.17,15.63) v1(38.17,14.83) v1(38.52,57.43) v1(38.52,56.63) v1(38.82,62.99) v1(38.92,13.37) v1(38.92,12.57) v1(38.97,15.63) v1(38.97,14.83) v1(39.32,57.43) v1(39.32,56.63) v1(39.3,11.09) v1(39.3,10.29) v1(39.3,9.49) v1(39.3,8.69) v1(39.3,7.89) v1(39.3,7.09) v1(39.4,47.23) v1(39.4,46.43) v1(39.4,45.63) v1(39.4,44.83) v1(39.81,62.99) v1(39.94,27.6) v1(39.96,14.81) v1(39.96,14.01) v1(40.04,12.79) v1(40.04,11.99) v1(40.1,11.09) v1(40.1,10.29) v1(40.1,9.49) v1(40.1,8.69) v1(40.1,7.89) v1(40.1,7.09) v1(40.2,47.23) v1(40.2,46.43) v1(40.2,45.63) v1(40.2,44.83) v1(40.4,22.3) v1(40.4,21.5) v1(40.42,20.16) v1(40.42,19.36) v1(40.47,24.3) v1(40.47,23.5) v1(40.6,26.7) v1(40.71,25.75) v1(40.8,62.99) v1(40.84,29.8) v1(40.76,14.81) v1(40.76,14.01) v1(40.84,12.79) v1(40.84,11.99) v1(41.1,31.13) v1(41.06,30.41) v1(41.15,27.45) v1(41.24,26.3) v1(41.2,22.3) v1(41.2,21.5) v1(41.22,20.16) v1(41.22,19.36) v1(41.27,24.3) v1(41.27,23.5) v1(41.42,7.59) v1(41.42,6.79) v1(41.85,26.71) v1(41.78,1.69) v1(41.78,0.89) v1(41.94,63.09) v1(41.94,53.03) v1(41.94,52.13) v1(41.97,53.92) v1(42.14,20.23) v1(42.14,19.44) v1(42.22,7.59) v1(42.22,6.79) v1(42.3,24.95) v1(42.3,24.15) v1(42.3,23.35) v1(42.3,22.55) v1(42.3,21.75) v1(42.3,20.95) v1(42.58,1.69) v1(42.58,0.89) v1(42.93,63.09) v1(42.94,20.23) v1(42.94,19.44) v1(42.96,59.9) v1(43.1,24.95) v1(43.1,24.15) v1(43.1,23.35) v1(43.1,22.55) v1(43.1,21.75) v1(43.1,20.95) v1(43.18,7.34) v1(43.18,6.54) v1(43.51,3.46) v1(43.51,2.66) v1(43.63,5.45) v1(43.63,4.65) v1(43.66,59.9) v1(43.66,50.36) v1(43.92,63.09) v1(43.98,7.34) v1(43.98,6.54) v1(44.07,54.61) v1(44.07,53.81) v1(44.1,52.98) v1(44.1,52.23) v1(44.31,3.46) v1(44.31,2.66) v1(44.43,5.45) v1(44.43,4.65) v1(44.7,50.34) v1(44.91,63.09) v1(44.87,54.61) v1(44.87,53.81) v1(44.9,52.98) v1(44.9,52.23) v1(45.09,1.65) v1(45.09,0.85) v1(45.89,1.65) v1(45.89,0.85) v1(46.24,63.11) v1(46.9,52.28) v1(46.99,51.26) v1(47.23,63.11) v1(47.19,41.49) v1(47.19,40.69) v1(47.9,29.77) v1(47.9,28.97) v1(47.99,41.49) v1(47.99,40.69) v1(48.22,63.11) v1(48.7,29.77) v1(48.7,28.97) v1(49.21,63.11) v1(49.85,34.56) v1(50.54,63.11) v1(50.65,34.56) v1(51.53,63.11) v1(52.52,63.11) v1(53.25,27.93) v1(53.25,27.13) v1(53.51,63.11) v1(53.59,40) v1(53.59,39.2) v1(53.69,28.67) v1(53.92,34.45) v1(53.96,38.36) v1(53.96,37.56) v1(54.05,27.93) v1(54.05,27.13) v1(54.39,41.73) v1(54.39,40.93) v1(54.4,40) v1(54.4,39.2) v1(54.53,28.98) v1(54.76,38.36) v1(54.76,37.56) v1(54.92,63.14) v1(55.19,41.73) v1(55.19,40.93) v1(55.19,40) v1(55.19,39.2) v1(55.21,34.31) v1(55.33,28.98) v1(55.33,28.18) v1(55.56,38.36) v1(55.56,37.56) v1(55.91,63.14) v1(56,40) v1(56,39.2) v1(56.36,38.36) v1(56.36,37.56) v1(56.51,21.45) v1(56.51,20.65) v1(56.57,23.47) v1(56.57,22.67) v1(56.79,40) v1(56.79,39.2) v1(56.9,63.14) v1(57.31,21.45) v1(57.31,20.65) v1(57.37,23.47) v1(57.37,22.67) v1(57.59,40) v1(57.59,39.2) v1(57.79,42.26) v1(57.79,41.46) v1(57.89,63.14) v1(58.34,58.27) v1(58.4,40) v1(58.4,39.2) v1(58.51,7.88) v1(58.51,7.08) v1(58.59,42.26) v1(58.59,41.46) v1(58.86,23.15) v1(58.86,22.35) v1(58.86,21.55) v1(58.86,20.75) v1(59.04,63.14) v1(59.1,15.94) v1(59.1,15.14) v1(59.19,40) v1(59.19,39.2) v1(59.31,7.88) v1(59.31,7.08) v1(59.4,58.24) v1(59.48,13.96) v1(59.5,12.23) v1(59.5,11.43) v1(59.74,48.46) v1(59.74,47.66) v1(59.66,23.15) v1(59.66,22.35) v1(59.66,21.55) v1(59.66,20.75) v1(59.91,15.94) v1(59.91,15.14) v1(59.92,14.49) v1(59.88,5.28) v1(59.88,4.48) v1(59.9,3.59) v1(59.9,2.79) v1(60.03,63.14) v1(60,40) v1(60,39.2) v1(60.03,10.93) v1(60.03,10.13) v1(60.03,9.33) v1(60.03,8.53) v1(60.03,7.73) v1(60.03,6.93) v1(60,1.85) v1(60,1.05) v1(60.1,50.68) v1(60.1,49.88) v1(60.12,25.55) v1(60.12,24.75) v1(60.28,13.96) v1(60.3,12.23) v1(60.51,52.4) v1(60.51,51.6) v1(60.54,48.46) v1(60.54,47.66) v1(60.7,11.61) v1(60.68,5.28) v1(60.68,4.48) v1(60.7,3.59) v1(60.7,2.79) v1(60.83,10.93) v1(60.83,10.13) v1(60.83,9.33) v1(60.83,8.53) v1(60.83,7.73) v1(60.83,6.93) v1(60.8,1.85) v1(60.8,1.05) v1(60.9,50.68) v1(60.9,49.88) v1(61.02,63.14) v1(61.07,14.62) v1(61.31,52.4) v1(61.31,51.6) v1(61.72,3.03) v1(61.72,2.23) v1(61.93,56.46) v1(61.9,42.2) v1(62.01,63.14) v1(62.1,5.17) v1(62.1,4.37) v1(62.28,10.54) v1(62.28,9.74) v1(62.52,3.03) v1(62.52,2.23) v1(62.56,42.66) v1(62.56,41.86) v1(62.73,40.52) v1(62.89,29.14) v1(62.89,28.33) v1(62.9,5.17) v1(62.9,4.37) v1(63,43.37) v1(63.01,30.71) v1(63.01,29.91) v1(62.96,27.35) v1(63.08,10.54) v1(63.08,9.74) v1(63.31,63.14) v1(63.51,42.26) v1(63.58,40.53) v1(63.69,29.14) v1(63.69,28.33) v1(63.8,56.81) v1(63.81,30.71) v1(63.81,29.91) v1(63.75,27.35) v1(64,51) v1(64,47.5) v1(64.12,10.43) v1(64.12,9.63) v1(64.25,58.53) v1(64.3,63.14) v1(64.31,42.26) v1(64.45,27.31) v1(64.74,30.67) v1(64.74,29.87) v1(64.7,29.17) v1(64.7,28.37) v1(64.91,10.43) v1(64.91,9.63) v1(65.13,41.29) v1(65.13,40.49) v1(65.29,63.14) v1(65.27,47.11) v1(65.27,46.31) v1(65.93,41.29) v1(65.93,40.49) v1(66.07,47.11) v1(66.07,46.31) v1(66.28,63.14) v1(66.33,62.27) v1(66.38,61.24) v1(66.83,41.23) v1(66.83,40.43) v1(67.13,63.07) v1(67.13,62.27) v1(67.63,41.23) v1(67.63,40.43) v1(67.64,27.72) v1(67.7,33.04) v1(67.71,24.13) v1(67.71,23.33) v1(67.78,30.39) v1(67.78,29.59) v1(68.19,26.73) v1(68.19,25.93) v1(68.32,33.79) v1(68.44,31.99) v1(68.44,31.19) v1(68.44,27.72) v1(68.51,24.13) v1(68.51,23.33) v1(68.59,35.21) v1(68.58,30.39) v1(68.58,29.59) v1(69.04,34.81) v1(69.04,34.01) v1(69.04,33.21) v1(69.04,32.41) v1(69.04,31.61) v1(69.04,29.21) v1(69.04,28.41) v1(69.04,27.61) v1(68.99,26.73) v1(68.99,25.93) v1(69.27,30.31) v1(69.39,36.01) v1(69.52,61.92) v1(69.52,61.12) v1(69.48,22.44) v1(69.58,37.41) v1(69.58,36.61) v1(69.72,32.59) v1(69.66,31.03) v1(69.84,34.81) v1(69.84,34.01) v1(69.84,33.21) v1(69.84,31.61) v1(69.84,30.01) v1(69.84,29.21) v1(69.84,28.41) v1(69.84,27.61) v1(69.79,24.25) v1(69.79,23.45) v1(70.03,21.5) v1(70.03,20.7) v1(70.14,26.87) v1(70.14,26.07) v1(70.32,61.12) v1(70.42,38.01) v1(70.42,37.21) v1(70.4,33.59) v1(70.37,32.14) v1(70.42,30.91) v1(70.57,36.15) v1(70.57,35.35) v1(70.59,24.25) v1(70.59,23.45) v1(70.68,29.56) v1(70.83,21.5) v1(70.83,20.7) v1(70.94,26.87) v1(70.94,26.07) v1(71.01,34.85) v1(71.22,38.01) v1(71.22,37.21) v1(71.37,36.15) v1(71.37,35.35) v1(71.36,29.57) v1(71.45,28.33) v1(71.62,2.17) v1(71.62,1.37) v1(72.05,26.68) v1(72.01,9.59) v1(72.12,11.31) v1(72.12,10.51) v1(72.19,28.25) v1(72.44,20.61) v1(72.44,19.81) v1(72.42,2.17) v1(72.42,1.37) v1(72.51,9.07) v1(72.78,60.87) v1(72.78,60.07) v1(72.93,19.34) v1(72.93,18.54) v1(72.92,11.31) v1(72.92,10.51) v1(73.15,28.77) v1(73.24,20.61) v1(73.58,60.87) v1(73.58,60.07) v1(73.73,19.34) v1(73.73,18.54) v1(73.74,2.13) v1(73.74,1.33) v1(73.94,29.08) v1(73.99,19.94) v1(73.97,7.89) v1(73.97,7.09) v1(74.12,11.24) v1(74.12,10.44) v1(74.26,38.41) v1(74.26,37.61) v1(74.53,2.13) v1(74.53,1.33) v1(74.77,7.89) v1(74.77,7.09) v1(75.06,38.41) v1(75.06,37.61) v1(75.5,60.77) v1(75.5,59.97) v1(75.93,2.21) v1(75.93,1.41) v1(76.3,60.77) v1(76.3,59.97) v1(76.48,38) v1(76.49,37.31) v1(76.72,2.21) v1(76.72,1.41) v1(76.76,18.03) v1(76.76,17.23) v1(77.03,56.16) v1(77.03,55.36) v1(77.01,52.3) v1(77.01,51.5) v1(77.12,19.37) v1(77.12,18.57) v1(77.21,54.29) v1(77.21,53.49) v1(77.17,48.63) v1(77.17,47.83) v1(77.28,38) v1(77.29,37.31) v1(77.58,46.8) v1(77.58,46) v1(77.56,18.03) v1(77.56,17.23) v1(77.83,56.16) v1(77.83,55.36) v1(77.81,52.3) v1(77.81,51.5) v1(77.92,19.37) v1(77.92,18.57) v1(78.01,54.29) v1(78.01,53.49) v1(77.98,49.59) v1(77.97,48.63) v1(77.97,47.83) v1(78.09,37.21) v1(78.17,26.34) v1(78.17,25.54) v1(78.3,36.53) v1(78.38,46.8) v1(78.38,46) v1(78.36,24.23) v1(78.36,23.43) v1(78.5,2.07) v1(78.5,1.27) v1(78.56,24.93) v1(78.9,48.2) v1(78.9,47.4) v1(78.97,25.54) v1(79.1,36.53) v1(79.2,46.5) v1(79.16,24.23) v1(79.16,23.43) v1(79.3,2.07) v1(79.3,1.27) v1(79.63,11.06) v1(79.63,10.26) v1(79.7,48.2) v1(79.7,47.4) v1(80.43,11.06) v1(80.43,10.26) v1(80.75,9.14) v1(80.75,8.34) v1(80.93,6.4) v1(80.93,5.6) v1(80.93,4.07) v1(80.93,3.27) v1(81.55,9.14) v1(81.55,8.34) v1(81.73,6.4) v1(81.73,5.6) v1(81.73,4.07) v1(81.73,3.27) v1(81.98,11.13) v1(81.98,10.33) v1(82.78,11.13) v1(82.78,10.33) v1(83.87,11.29) v1(83.87,10.49) v1(83.98,47.95) v1(83.98,47.15) v1(84.41,56.08) v1(84.41,55.28) v1(84.67,11.29) v1(84.67,10.49) v1(84.78,47.95) v1(84.78,47.15) v1(84.76,36.79) v1(84.76,35.99) v1(85.21,56.08) v1(85.21,55.28) v1(85.27,23.2) v1(85.44,27.79) v1(85.44,26.99) v1(85.55,49.04) v1(85.55,48.24) v1(85.56,36.79) v1(85.56,35.99) v1(85.74,52.86) v1(85.74,52.06) v1(86.02,23.15) v1(86.24,27.79) v1(86.24,26.99) v1(86.35,49.04) v1(86.35,48.24) v1(86.39,36.33) v1(86.39,35.53) v1(86.44,30.88) v1(86.44,30.08) v1(86.54,52.86) v1(86.54,52.06) v1(86.5,34.46) v1(86.5,33.66) v1(86.5,32.69) v1(86.5,31.89) v1(86.47,29.28) v1(86.74,23.44) v1(87.09,49.4) v1(87.25,30.88) v1(87.25,30.08) v1(87.21,29.22) v1(87.15,28.34) v1(87.15,27.54) v1(87.28,51.66) v1(87.3,33.66) v1(87.3,32.69) v1(87.3,31.89) v1(87.41,52.53) v1(87.54,23.44) v1(87.55,48.91) v1(87.68,26.75) v1(87.68,25.95) v1(87.68,25.15) v1(87.68,24.35) v1(87.95,28.34) v1(87.95,27.54) v1(88.13,48.64) v1(88.15,46.89) v1(88.15,46.09) v1(88.16,49.32) v1(88.16,45.08) v1(88.16,44.28) v1(88.25,19.94) v1(88.25,19.14) v1(88.29,18.19) v1(88.29,17.39) v1(88.47,47.94) v1(88.48,26.75) v1(88.48,25.95) v1(88.48,25.15) v1(88.48,24.35) v1(88.67,16.38) v1(88.67,15.58) v1(88.91,49.32) v1(88.95,46.89) v1(88.95,46.09) v1(88.96,45.08) v1(88.96,44.28) v1(89.05,19.94) v1(89.05,19.14) v1(89.09,18.19) v1(89.09,17.39) v1(89.09,14.73) v1(89.09,13.93) v1(89.27,48.74) v1(89.27,47.94) v1(89.47,16.38) v1(89.47,15.58) v1(89.89,14.73) v1(89.89,13.93) v1(90.99,16.07) v1(90.99,15.27) v1(91.79,16.07) v1(91.79,15.27) v1(92.07,18.1) v1(92.07,17.3) v1(92.35,15.75) v1(92.87,18.1) v1(92.87,17.3) v1(93.27,14.95) v1(93.27,14.15) v1(93.39,16.13) v1(94.07,14.95) v1(94.07,14.15) v1(95.5,15.64) v1(95.52,14.72)
VCC: length 268.8
  Top Layer w0.3: 52.53,35.5 52.4,35.37 R34.1 ; 46.18,35.5 46.1,35.42 R29.2 ; C35.1 48.15,32.72 ; 48.15,32.72 47.58,32.72 47.26,32.4 47.26,30.35 47,30.09 47,26.07 47.47,25.6 U9.15 ; 48.15,32.72 48.13,32.74 48.13,35.5 ; U8.15 26.03,25.6 25.56,26.08 25.56,32.27 25.96,32.67 C34.1 26.6,35.44 26.66,35.5 ; 30.84,35.5 30.8,35.46 R33.1
  Top Layer w0.4: 17.01,22.23 16.98,22.23 R90.1 ; 17.01,22.23 17.78,21.46 17.78,17.44 ; 17.01,22.23 17.01,33.51 18.29,34.79 H1.1 ; R28.2 24.5,34 26,35.5 63.16,35.5 C42.1
  Top Layer w0.5: v1(70.73,54.09) 70.73,57.49 68.14,60.08 v2(66.8,60.08) ; v2(29.93,54.47) 30.35,54.05 U2.16
  Top Layer w0.6: v2(29.93,54.47) 28.13,54.47 C3.1 ; U20.5 72.92,46.94 R15.1 72.93,48 R91.2 74.84,46.03 76.18,44.69 v2(77.94,44.69) ; C42.1 65.78,35.63 C70.1 ; R93.2 87.95,37.8 86.48,39.27
  Top Layer w0.8: D5.1 65.8,24.97 C70.1 71.62,41.44 81.02,41.44 C69.1 ; L3.1 80.24,34.9 78.15,32.81 U10.3 ; C12.2 84.07,44.82 U3.3
  Top Layer w1: C69.1 82.3,38.03 L3.1 ; C69.1 83.96,39.69 U3.3 ; C69.1 86.31,39.1 86.48,39.27
  Bottom Layer w0.5: v1(70.73,54.09) 70.73,47.86 v1(72.28,46.3)
  Bottom Layer w0.6: v2(66.8,60.08) 63.31,60.08 63.3,60.07 62.7,60.07 62.69,60.08 46.74,60.08 45.46,61.35 36.81,61.35 v2(29.93,54.47) 20.94,54.47 15.6,49.14 15.6,39.77 H1.1 ; v3(85.34,44.78) 85.25,44.69 v2(77.94,44.69)
(no net):
  vias: v1(73.25,33.58) v1(73.23,32.95) v1(73.25,32.33) v1(73.22,31.65) v1(73.23,30.9) v1(73.89,33.58) v1(73.87,32.95) v1(73.89,32.33) v1(73.86,31.65) v1(73.87,30.9) v1(74.52,33.58) v1(74.51,32.95) v1(74.52,32.33) v1(74.49,31.65) v1(74.5,30.9) v1(75.15,32.95) v1(75.13,31.65) v1(75.14,30.9) v1(75.16,33.58) v1(75.16,32.33)
BOOT0: length 21.4
  Top Layer w0.3: U5.44 45.25,45.75 46.7,44.3 50.2,44.3 51.9,42.6 v1(56,42.6) ; v1(56,46.8) R6.2
  Bottom Layer w0.3: 56,45.3 v1(56,46.8) ; 56,45.3 v1(56,42.6) ; 56,45.3 56,44.2
BOOT1: length 17.5
  Top Layer w0.3: 43.75,58.3 U5.20 v1(43.75,58.55) ; R7.2 57.3,58.55
  Bottom Layer w0.3: v1(43.75,58.55) v1(57.25,58.55)
EX1: length 55.6
  Top Layer w0.254: v2(44.49,44.27) 44.25,44.52 44.25,48.45 ; v2(10.25,19.44) 10.25,17.66 R89.2
  Bottom Layer w0.254: v2(10.25,19.44) 10.25,25.6 22.69,38.04 33.42,38.04 34.78,39.39 41.86,39.39 43.79,41.32 43.79,43.57 v2(44.49,44.27)
EX2: length 56.3
  Top Layer w0.254: 15.49,17.44 15.49,19.33 16.11,19.94 ; 44.75,48.45 44.75,45.39 46.32,43.83 46.32,41.61 42.9,38.19 22.65,38.19 19.65,35.2 v2(19.65,34.04)
  Bottom Layer w0.254: v2(16.09,19.92) 16.09,30.47 v2(19.65,34.04)
EX3: length 25.9
  Top Layer w0.3: v1(61.45,48.68) 61.45,46.55 59.79,44.9 52.3,44.9 51.9,45.3 51.9,50.4 50.75,51.55 U5.4 ; v2(64.19,49.12) 64.2,49.11 R20.2
  Bottom Layer w0.3: v1(61.45,48.68) 61.89,49.12 v2(64.19,49.12)
LO: length 45.9
  Top Layer w0.3: R11.2 61.9,18.31 61.9,33.69 v1(61.05,34.53) ; U5.3 50.55,51.05 51.3,50.3 51.3,45.1 52.2,44.2 v1(61,44.2)
  Bottom Layer w0.3: v1(61.05,34.53) 61,34.58 v1(61,44.2)
LO_OUT: length 8.1
  Top Layer w0.8: P1.1 66.2,7.68 F1.2
LX: length 48
  Top Layer w0.4: v2(76.24,47.05) 76.24,51.9 75.13,53 R17.2 R18.1
  Bottom Layer w0.4: v2(76.24,47.05) 76.24,40.46 76.83,39.87 88.36,39.87 90.66,37.57 90.66,27.43 P4.3
LY: length 54.7
  Top Layer w0.4: R13.1 v1(65.5,54.1) R12.1
  Bottom Layer w0.4: P4.2 92.5,20.85 89.46,23.89 89.46,28.96 88,30.42 88,37.61 86.46,39.15 76.48,39.15 73.94,41.68 73.94,42.65 65.5,51.09 v1(65.5,54.1)
MOTOR_EN: length 89.3
  Top Layer w0.3: v1(59.61,28.37) 54.34,23.1 U9.2 ; 46.9,59.8 45.75,58.65 U5.16 v1(45.75,55.55) ; v1(38.01,28.31) 32.8,23.1 U8.2 ; v1(59.61,36.2) v1(48.8,36.2) 38.03,36.2 v1(38.01,36.21)
  Bottom Layer w0.3: v1(59.61,28.37) v1(59.61,36.2) ; v1(45.75,55.55) 45.75,55.95 47.7,57.9 50.2,57.9 52.3,55.8 52.3,39.7 v1(48.8,36.2) ; v1(38.01,28.31) v1(38.01,36.21)
MX_1A: length 25.4
  Top Layer w0.3: 28.46,19.94 U8.24
  Top Layer w0.8: R38.1 28.27,12.2 28.32,12.25 ; 28.45,19.94 28.32,19.81 28.32,12.25 ; P7.2 33.26,3.4 28.32,8.34 28.32,12.25
MX_1B: length 25.6
  Top Layer w0.3: 26.46,22.6 26.46,22.4 25.83,21.77
  Top Layer w0.8: P7.1 30.62,3.07 R37.1 23.36,9.4 22.76,10 22.76,18.7 25.83,21.77
MX_2A: length 25.4
  Top Layer w0.3: 29.46,19.84 U8.26
  Top Layer w0.8: 29.59,12.2 29.59,19.56 ; 29.59,12.2 29.59,9.65 35.8,3.44 P7.3 ; 29.59,12.2 29.59,12.2 R39.1
MX_2B: length 24.7
  Top Layer w0.3: 32.1,21.6 31.46,22.24 31.46,22.6
  Top Layer w0.8: 34.93,9.48 34.93,18.78 32.1,21.6 ; 34.93,9.48 34.85,9.4 R40.1 ; 34.93,9.48 34.93,7.88 38.44,4.37 P7.4
MX_DIR: length 61.6
  Top Layer w0.3: v1(46,37.8) 45.79,37.59 25.65,37.59 23.36,35.3 v1(23,35.3) ; v1(21.8,28.2) 21.8,26.7 24.9,23.6 U8.19 ; U5.13 v1(48.2,57.1)
  Bottom Layer w0.3: v1(48.2,57.1) 49.6,55.7 49.6,41.1 46.3,37.8 v1(46,37.8) ; v1(21.8,28.2) 23,29.4 v1(23,35.3)
MX_STEP: length 55.7
  Top Layer w0.3: v1(50.4,54.3) 50.15,54.55 U5.10 ; U8.16 25.5,25.1 23.6,27 v1(23.6,29.2) ; v1(46.6,37) 46.43,36.83 26.16,36.83 23.89,34.56 v1(23.66,34.56)
  Bottom Layer w0.3: v1(23.6,29.2) 23.6,34.5 ; v1(50.4,54.3) 50.4,40.8 v1(46.6,37)
MY1_1A: length 23.9
  Top Layer w0.3: 50,19.94 U9.24
  Top Layer w0.8: 49.91,12.23 49.91,8.64 51.94,6.6 51.94,2.41 ; 49.91,12.23 49.88,12.2 R42.1 ; 49.91,12.23 49.91,19.69
MY1_1B: length 24.1
  Top Layer w0.3: 48.01,22.41 47.36,21.76
  Top Layer w0.8: P8.1 49.3,5.93 R41.1 44.9,9.4 44.3,10 44.3,18.7 47.36,21.76
MY1_2A: length 24.2
  Top Layer w0.3: 51,20 U9.26
  Top Layer w0.8: P8.3 54.48,6.48 51.05,9.91 51.05,12.23 ; 51.05,12.23 51.08,12.2 R43.1 ; 51.05,12.23 51.05,19.69
MY1_2B: length 23.1
  Top Layer w0.3: 53.64,21.6 53,22.24 53,22.6
  Top Layer w0.8: P8.4 57.12,6.5 54.95,8.67 R44.1 56.44,10.89 56.44,18.8 53.64,21.6
MY_DIR: length 46.6
  Top Layer w0.3: U9.19 46.44,23.6 43.34,26.7 v1(43.34,28.2) ; U5.14 46.75,58.2 47.05,58.5 48.4,58.5 v1(50.4,56.5)
  Bottom Layer w0.3: v1(43.34,28.2) 45.3,28.2 46,28.9 46,34.5 51.7,40.2 51.7,55.2 v1(50.4,56.5)
MY_STEP: length 36.4
  Top Layer w0.3: v1(50.4,55.3) 50.15,55.05 U5.11 ; U9.16 47.04,25.1 45.14,27 v1(45.14,29.2)
  Bottom Layer w0.3: v1(45.14,29.2) 45.14,34.54 51.1,40.5 51.1,54.6 v1(50.4,55.3)
NRST: length 19.8
  Top Layer w0.3: C15.2 R8.2 56.69,55.2 56.01,55.88 56.01,59.06 55.26,59.8 52.56,59.8 51.7,58.94 51.7,54.3 50.45,53.05 U5.7
PWM_5V: length 21.4
  Top Layer w0.5: R9.1 77.24,43.18 v2(77.27,43.15)
  Bottom Layer w0.5: P3.3 90.78,43.15 v2(77.27,43.15)
RST: length 34.2
  Top Layer w0.3: U5.41 43.75,41.85 43.1,41.2 39.5,41.2 36.07,44.63 36.07,47.46
  Top Layer w0.4: v2(32.48,47.14) 33.03,46.59 35.21,46.59 36.07,47.46 C5.2 ; v2(32.5,50.26) 32.53,50.3 32.53,56.66 R85.1
  Bottom Layer w0.4: v2(32.48,47.14) 32.48,50.25 v2(32.5,50.26)
RXD: length 22.7
  Top Layer w0.3: R27.2 v1(37.5,51.8) 38.25,52.55 U5.31 ; v1(20.43,51.12) 19.95,51.61 R1.2
  Bottom Layer w0.3: v1(20.43,51.12) 20.66,51.34 37.04,51.34 v1(37.5,51.8)
SPINDLE_PWM: length 57.8
  Top Layer w0.3: U5.29 38.85,53.55 37,55.4 37,59.5 39.7,62.2 v1(63,62.2) ; R48.1 64.23,44.11 63,45.34 v1(63,60.8)
  Top Layer w0.5: R48.1 65.82,44.07 U20.2
  Bottom Layer w0.3: v1(63,60.8) v1(63,62.2)
SWCLK: length 6.3
  Top Layer w0.3: U5.37 41.75,43.25 P5.3
SWDIO: length 12.1
  Top Layer w0.3: U5.34 37.85,51.05 v1(37.5,50.7)
  Bottom Layer w0.3: P5.4 37.5,44.96 v1(37.5,50.7)
TXD: length 25.6
  Top Layer w0.3: R3.2 19.15,50.67 v1(19.14,50.67) ; R30.2 v1(37.5,53.8) 38.25,53.05 U5.30
  Bottom Layer w0.3: v1(37.5,53.8) 36.01,52.31 19.93,52.31 19.14,51.52 v1(19.14,50.67)
USB_DM: length 4.7
  Top Layer w0.4: U4.3 13.81,42.94 P2.2
USB_DP: length 8.4
  Top Layer w0.4: P2.3 9.75,42.41 12.17,44.84 U4.1
VM: length 139.7
  Top Layer w0.3: 48.13,20.7 48.13,20.73 49,21.6 ; 31.37,20.45 31.37,20.69 U8.28 ; 26.67,20.83 26.68,20.83 27.45,21.6 ; U9.28 52.65,20.95 52.71,20.95
  Top Layer w0.4: v2(61.1,17.55) 61.1,32.51 59.47,34.14 57.35,34.14 56.6,33.38 C31.2 ; C30.2 36.14,33.82 37.66,33.82 38.66,32.82 38.66,29.87 39.05,29.48 v2(39.05,17.46)
  Top Layer w0.8: 48.13,20.7 46.86,19.43 46.86,18.35 C44.1 v3(47.5,17.53) ; v3(25.91,17.4) 24.58,17.4 C47.1 24.45,18.61 26.54,20.7 ; 52.71,20.95 54.8,18.86 C45.1 v3(53.21,17.53) ; v3(31.88,17.53) C46.1 33.33,18.48 31.5,20.32
  Top Layer w1.5: C2.1 78.08,9.92 P1.4 ; C2.1 70.71,17.29 v3(70.19,17.29) ; C2.1 75.66,13.32 DZ3.2
  Bottom Layer w1.5: v3(70.19,17.29) 70.11,17.38 69.53,17.38 69.5,17.4 v3(25.91,17.4)
VUSB: length 17.9
  Top Layer w0.4: P2.1 13.86,40.48 15.14,40.48 17.08,42.43 17.08,43.33 17.64,43.89 U4.5
  Top Layer w0.6: P2.1 11.75,30.74 D1.1
X_LIMT: length 37.5
  Top Layer w0.254: v1(40.22,56.85) 40.2,56.83 U5.25 ; v1(70.27,59.04) 70.39,59.04 72.19,57.23
  Top Layer w0.3: C19.2 72.19,57.23 72.19,55.21 R18.2
  Bottom Layer w0.254: v1(70.27,59.04) 70.11,59.19 41.91,59.19 40.22,57.5 v1(40.22,56.85)
XTAL1: length 13.3
  Top Layer w0.3: U5.5 52.95,52.05 53.5,51.5 53.5,48.9 ; C17.1 53.6,49 53.5,48.9 ; Y2.1 53.5,48.9
XTAL2: length 13.5
  Top Layer w0.3: 53.5,53.1 52.95,52.55 U5.6 ; 53.5,53.1 55.5,51.1 C16.1 ; 53.5,53.1 Y2.2
Y_LIMT: length 41.8
  Top Layer w0.3: U5.28 39.1,54.05 37.6,55.55 37.6,59.2 39.9,61.5 63.9,61.5 ; R13.2 67.07,55.22 C18.2 67.07,57.43 65.4,59.1 65.4,60 63.9,61.5 ; 63.9,61.5 63.91,61.5
$1N59: length 9.5
  Top Layer w0.3: C28.2 37.1,29.2 32.5,24.6 U8.5
$1N60: length 12.6
  Top Layer w0.3: U8.4 32.78,24.1 38.1,29.42 38.1,31.9 37.33,32.67 C28.1
$1N61: length 7.9
  Top Layer w0.3: C30.1 35,27.9 32.2,25.1 U8.6
$1N63: length 5.5
  Top Layer w0.3: C36.1 30.46,28.68 U8.8
$1N64: length 4.8
  Top Layer w0.3: 28.7,31.08 28.7,30.7 27.96,29.96 U8.13
$1N66: length 18.8
  Top Layer w0.3: 21.6,33.95 20.32,32.67 C32.1 17.97,32.67 17.7,32.4 17.7,30.2 19,28.9 22.4,28.9 22.75,28.55 22.75,26.95 25.1,24.6 U8.17
$1N71: length 8.4
  Top Layer w0.3: U8.23 27.96,20.66 27.4,20.1
  Top Layer w0.8: R24.2 25.41,15 27.18,16.76 27.18,19.81
$1N75: length 8.7
  Top Layer w0.3: 30.61,19.69 30.61,19.99 29.96,20.64 U8.27
  Top Layer w0.8: R23.1 32.24,15 30.61,16.64 30.61,19.69
$1N80: length 9.5
  Top Layer w0.3: 58.64,31.13 58.64,29.2 54.04,24.6 U9.5
$1N81: length 12.7
  Top Layer w0.3: U9.4 54.32,24.1 59.74,29.52 59.74,31.8 58.87,32.67 58.64,32.67
$1N82: length 7.9
  Top Layer w0.3: 56.54,31.13 56.54,27.9 53.74,25.1 U9.6
$1N84: length 5.5
  Top Layer w0.3: U9.8 52,28.68 54.44,31.13
$1N85: length 4.8
  Top Layer w0.3: 50.24,31.08 50.24,30.7 49.5,29.96 U9.13
$1N88: length 18.8
  Top Layer w0.3: U9.17 46.64,24.6 44.29,26.95 44.29,28.55 43.94,28.9 40.54,28.9 39.2,30.24 39.2,32.36 39.52,32.67 C33.1 41.87,32.67 43.14,33.95
$1N93: length 8.4
  Top Layer w0.3: U9.23 49.5,20.66 49.14,20.3
  Top Layer w0.8: 48.9,20.07 48.9,17.02 46.88,15 R26.2
$1N97: length 8.9
  Top Layer w0.3: U9.27 51.5,20.64 52.07,20.07
  Top Layer w0.8: 52.07,19.94 52.07,16.13 53.2,15 R25.1
$1N115: length 12.4
  Top Layer w0.3: U8.11 v1(28.96,27.74) ; v1(28.96,27.74) 29.46,27.74 ; v1(28.96,27.74) 28.74,27.74 28.46,27.46 U8.12 ; 29.46,27.74 U8.10 ; 29.46,27.74 29.96,27.74 ; 27.45,26.6 27.45,27.55 v1(27.3,27.7) ; U8.9 29.96,27.74 ; 29.96,27.74 29.96,30.06 30.8,30.9 R33.2
  Bottom Layer w0.3: v1(27.3,27.7) 28.91,27.7 v1(28.96,27.74)
$1N116: length 12.4
  Top Layer w0.3: U9.10 51,27.74 ; 51,27.74 51.5,27.74 ; 51,27.74 v1(50.5,27.74) ; v1(50.5,27.74) 50.29,27.74 50,27.46 U9.12 ; v1(50.5,27.74) U9.11 ; 52.34,31.1 52.34,30.9 51.5,30.06 51.5,27.74 ; v1(48.84,27.7) 49,27.55 49,26.6 ; U9.9 51.5,27.74
  Bottom Layer w0.3: v1(48.84,27.7) 50.46,27.7
$1N125: length 3.4
  Top Layer w0.254: U2.4 22.54,48.81 21.5,47.77
$1N128: length 4.6
  Top Layer w0.4: C5.1 33.41,48.81 U2.13
$1N132: length 7.2
  Top Layer w0.4: U2.5 22.85,47.54 20.14,44.84 U4.6
$1N135: length 7.4
  Top Layer w0.4: U4.4 19.47,42.94 22.8,46.27 U2.6
$1N136: length 12.1
  Top Layer w0.254: C11.1 32.51,41.15 31.83,40.47 Y1.2 27.25,40.47 26.95,40.77 26.95,43.67 25.62,45 U2.7
$1N137: length 9.1
  Top Layer w0.254: 24.5,40.62 24.44,40.68 22.62,40.68 C13.1 ; 24.5,40.62 26.09,40.62 26.35,40.87 26.35,43.17 25.82,43.7 U2.8 ; 24.5,40.62 Y1.1
$1N138: length 2.4
  Top Layer w0.5: R9.2 73.31,43.12 U20.4
$1N142: length 6.6
  Top Layer w0.8: F1.1 66.26,14.32 66.73,14.78 R10.2
  Top Layer w1: Q1.2 66.26,14.32
$1N144: length 28.8
  Top Layer w0.4: Q2.2 72.75,49.78 R15.2 72.92,49.62 v2(72.92,50.64)
  Top Layer w0.5: D8.2 71.05,47.69 Q2.2
  Bottom Layer w0.4: v2(72.92,50.64) 91.41,50.64 P6.2
$1N164: length 11
  Top Layer w0.3: R12.2 68.22,53 R92.1 70.08,53 R17.1
  Top Layer w0.4: 74.84,49.6 74.84,50.69 73.94,51.59 72.81,51.59 72.2,52.2 R17.1
$1N165: length 5
  Top Layer w0.3: R11.1 R14.1 63.63,13.48 Q1.1
$1N2613: length 2.1
  Top Layer w0.3: R2.2 81.28,60.44 D3.1
$1N2624: length 2.1
  Top Layer w0.3: R28.1 23.15,31.1 22.6,30.55
$1N2639: length 2.1
  Top Layer w0.3: 46.04,31.1 44.69,31.1 44.14,30.55
$1N2662: length 3.2
  Top Layer w0.254: R1.1 22.17,51.35 U2.2
$1N2663: length 3
  Top Layer w0.254: U2.3 21.76,50.08 R3.1
$1N2693: length 2.8
  Top Layer w0.3: Q2.1 68.58,50.71 R20.1
$1N9328: length 7
  Top Layer w0.6: H1.2 15.75,30.54 15.44,30.23
$1N9382: length 18.4
  Top Layer w0.8: H2.2 87.68,21.34 90.73,24.39 90.73,30.02 P3.1
$1N9395: length 11.5
  Top Layer w0.6: R93.1 91.15,35.42 v1(92.02,34.55)
  Bottom Layer w0.6: P4.5 92.02,31.25 v1(92.02,34.55)
$1N11867: length 17.6
  Top Layer w0.5: R86.1 R85.2 29.84,57.57 K1.4 20.69,57.57 ; C64.2 20.69,57.56 20.69,57.57 ; 20.69,57.57 K1.3
$1N11898: length 11.7
  Top Layer w0.5: K1.2 K1.1 15.98,62.07 D28.1
$1N12391: length 16.4
  Top Layer w0.4: P9.2 24.61,2.84 D29.2 20.54,7.55 17.84,10.25 Q3.2 17.84,15.82 R88.2
$1N12399: length 2.2
  Top Layer w0.4: Q3.1 15.49,13.76 R87.1
$1N12595: length 15.4
  Top Layer w0.4: P10.2 16.61,6.24 D30.2 15.86,8.22 12.38,11.71 Q4.2 12.32,13.01 R90.2
$1N12603: length 2.1
  Top Layer w0.4: R89.1 10.16,14.14 Q4.1
$1N12641: length 3.6
  Top Layer w0.8: 65.79,20.38 65.13,19.72 R10.1
$3N13716: length 10.3
  Top Layer w0.8: U10.2 79.33,31.54 82.3,28.58 L3.2 81.72,27.52 D27.2
$3N13784: length 4.1
  Top Layer w0.5: R47.1 76.04,36.19 77.1,35.14 U10.4

## Copper pours and planes (outline as drawn; the poured copper is in the pictures)
GND on Top Layer: -7,68.6 -7,-4.3 101,-4.3 101,68.1 -6.7,68.1
GND on Bottom Layer: -6.7,69.2 102.5,69.2 102.5,-6.3 -6.7,-6.3
MY1_2B on Top Layer: 52.6,22.71 53.81,22.71 53.81,21.4 52.6,21.4
VM on Top Layer: 30.46,21.92 31.69,21.92 31.69,20.2 30.46,20.2
VM on Top Layer: 48.02,22.02 49.1,22.02 49.1,20.57 48.02,20.57
VM on Top Layer: 52.02,22.04 53.25,22.04 53.25,20.31 52.02,20.31
VM on Top Layer: 26.48,22.05 27.56,22.05 27.56,20.6 26.48,20.6

Small or netless copper shapes (teardrops, artwork), in the pictures only: 422 on Top Layer, 59 on Bottom Layer

## Text on the board
Top Silkscreen Layer: 3V3 | GND | EX1 | EX2 | PWM | LO | 5V | 24V | LX | LY | Rest | X-MOTOR | X | Y | Y-MOTOR
